# EAGLE design swith_adapter (EAGLE 6.2)
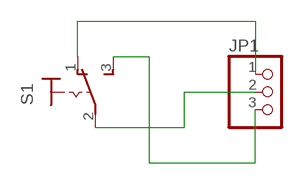
[diagram p0: schematic, sheet 1]

## Parts
JP1  PINHD-1X3  [1X03]
S1  320-916  [320-916]

## Nets
N$1: JP1.2 S1.2(P)
N$2: JP1.1 S1.1(O)
N$3: JP1.3 S1.3(S)

## Library data of the parts
JP1 = pinhead:PINHD-1X3: PIN HEADER
S1 = switch:320-916: TOGGLE SWITCH distributor RS Components

## Board
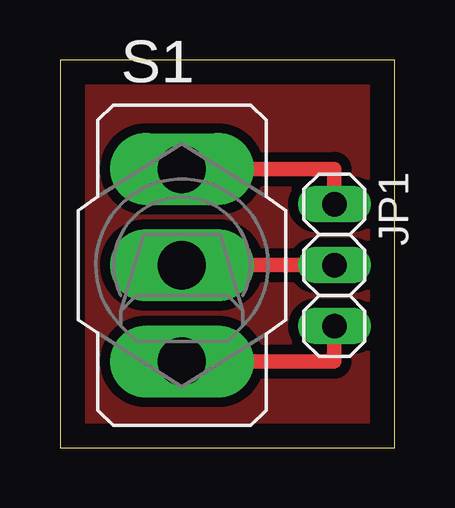
[diagram p1: board, top side]
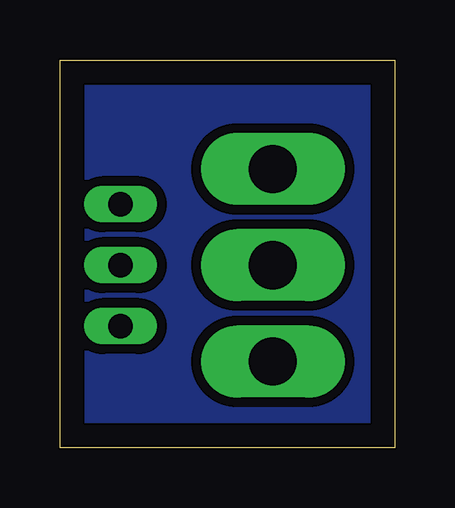
[diagram p2: board, bottom side, seen from below]

Size 13.95 x 16.18 mm. Coordinates in mm from the lower left corner, seen from the top.
Outline: 0,0 13.95,0 13.95,16.18 0,16.18 0,0
Copper layers (1*16): Top 0.035mm / dielectric 1.5mm / Bottom 0.035mm
Design rules: minimum track width 10mil, minimum drill 24mil, track to track 8mil, track to pad 8mil, pad to pad 8mil, via to via 8mil, smd to smd 8mil, copper to edge 40mil, drill to drill 8mil, minimum pad ring 10mil, minimum via ring 8mil, stop-mask expansion 4mil, vias tented up to drill 0mil, thermal gap 10mil

### Footprints (pad centres in the part's own frame; a part is rotated, then mirrored left to right if it is on the bottom)
1X03 = drill 1.016 long: 1 -2.54,0; 2 0,0; 3 2.54,0
320-916 = drill 2.007 long: 1 0,4.013; 2 0,0; 3 0,-4.013

### Placement (x,y rotation side)
JP1  11.43,7.62 270 top
S1  5.08,7.62 0 top

### Tracks (layer width: path | path; a pad name or v marks a point on that pad's centre or on a via)
N$1
  Top 0.61: S1.2 JP1.2
N$2
  Top 0.61: S1.1 11.43,11.63 JP1.1
N$3
  Top 0.61: S1.3 11.43,3.61 JP1.3
N$4
  pour Top (isolate 0.406): -0.13,16.13 -0.13,0 13.97,0 13.97,16.26 -0.13,16.26
  pour Bottom (isolate 0.406): -0.38,16.26 -0.25,-0.13 13.97,0 13.84,16.26